# EAGLE design haystack_rgb_single_wires (EAGLE 9.1.0)
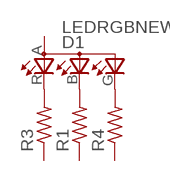
[diagram p0: schematic, sheet 1]

## Parts
D1  LEDRGBNEW  [P-LCC-4]
R1  RES-US1206  [R1206]
R3  RES-US1206  [R1206]
R4  RES-US1206  [R1206]

## Nets
N$1: D1.B(CBLUE) R1.2
N$2: D1.R(CRED) R3.2
N$3: D1.G(CGREEN) R4.2
Unconnected: D1.A(A2) R1.1 R3.1 R4.1

## Library data of the parts
D1 = fab :LEDRGBNEW
R1 R3 R4 = fab :RES-US: Resistor (US Symbol) Variants with postfix FAB are widened to allow the routing of internal traces

## Board
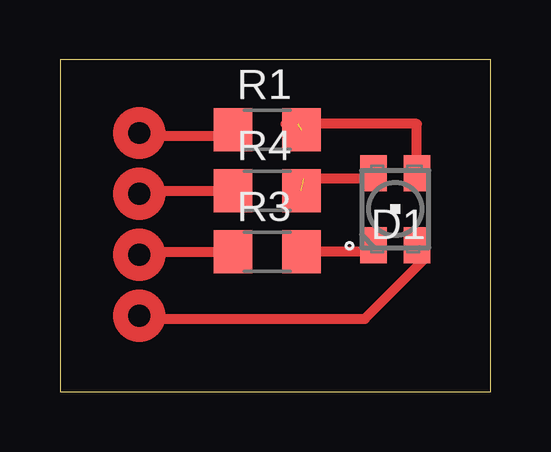
[diagram p1: board, top side]
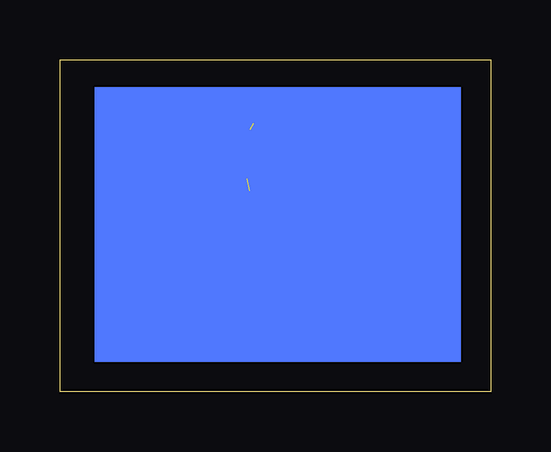
[diagram p2: board, bottom side, seen from below]

Size 17.96 x 13.83 mm. Coordinates in mm from the lower left corner, seen from the top.
Outline: 0,0 17.96,0 17.96,13.83 0,13.83 0,0
Copper layers (1*16): Top 0.035mm / dielectric 1.5mm / Bottom 0.035mm
Design rules "default": minimum track width 6mil, minimum drill 0.35mm, track to track 6mil, track to pad 6mil, pad to pad 6mil, via to via 6mil, smd to smd 6mil, copper to edge 40mil, drill to drill 6mil, minimum pad ring 10mil, minimum via ring 8mil, stop-mask expansion 4mil, vias tented up to drill 0mil, thermal gap 10mil

### Footprints (pad centres in the part's own frame; a part is rotated, then mirrored left to right if it is on the bottom)
P-LCC-4 = smd 1.1 x 1.5: A 0.902,-1.5; B 0.902,1.5; G -0.902,1.5; R -0.902,-1.5
R1206 = smd 1.6 x 1.803: 1 -1.422,0; 2 1.422,0

### Placement (x,y rotation side)
D1  13.97,7.62 0 top
R1  8.64,10.92 0 top
R3  8.64,5.84 0 top
R4  8.64,8.38 0 top

### Tracks (layer width: path | path; a pad name or v marks a point on that pad's centre or on a via)
N$1  (1 unrouted)
  Top 0.406: D1.B 14.87,11.18 9.91,11.18 9.4,11.18
N$2
  Top 0.406: D1.R 13.07,5.84 R3.2
N$3  (1 unrouted)
  Top 0.406: D1.G 13.07,8.89 10.16,8.89
N$4
  Top 0.406: 14.99,6.1 15.24,6.1 | 4.32,3.05 12.7,3.05 15.11,5.46 15.11,5.97 14.99,6.1 | 14.73,6.1 14.99,6.1
N$7
  Top 0.406: 4.06,10.67 7.11,10.67 7.11,10.92
N$8
  Top 0.406: 4.06,8.13 4.06,8.38 7.62,8.38
N$9
  Top 0.406: 4.32,5.84 7.11,5.84
(copper drawn outside any net)
  shapes: Bottom area x1, Top circle x4